# EAGLE design SparkFun_AzureWave_Module_Thing_Plus_AW-CU488 (EAGLE 9.6.2)
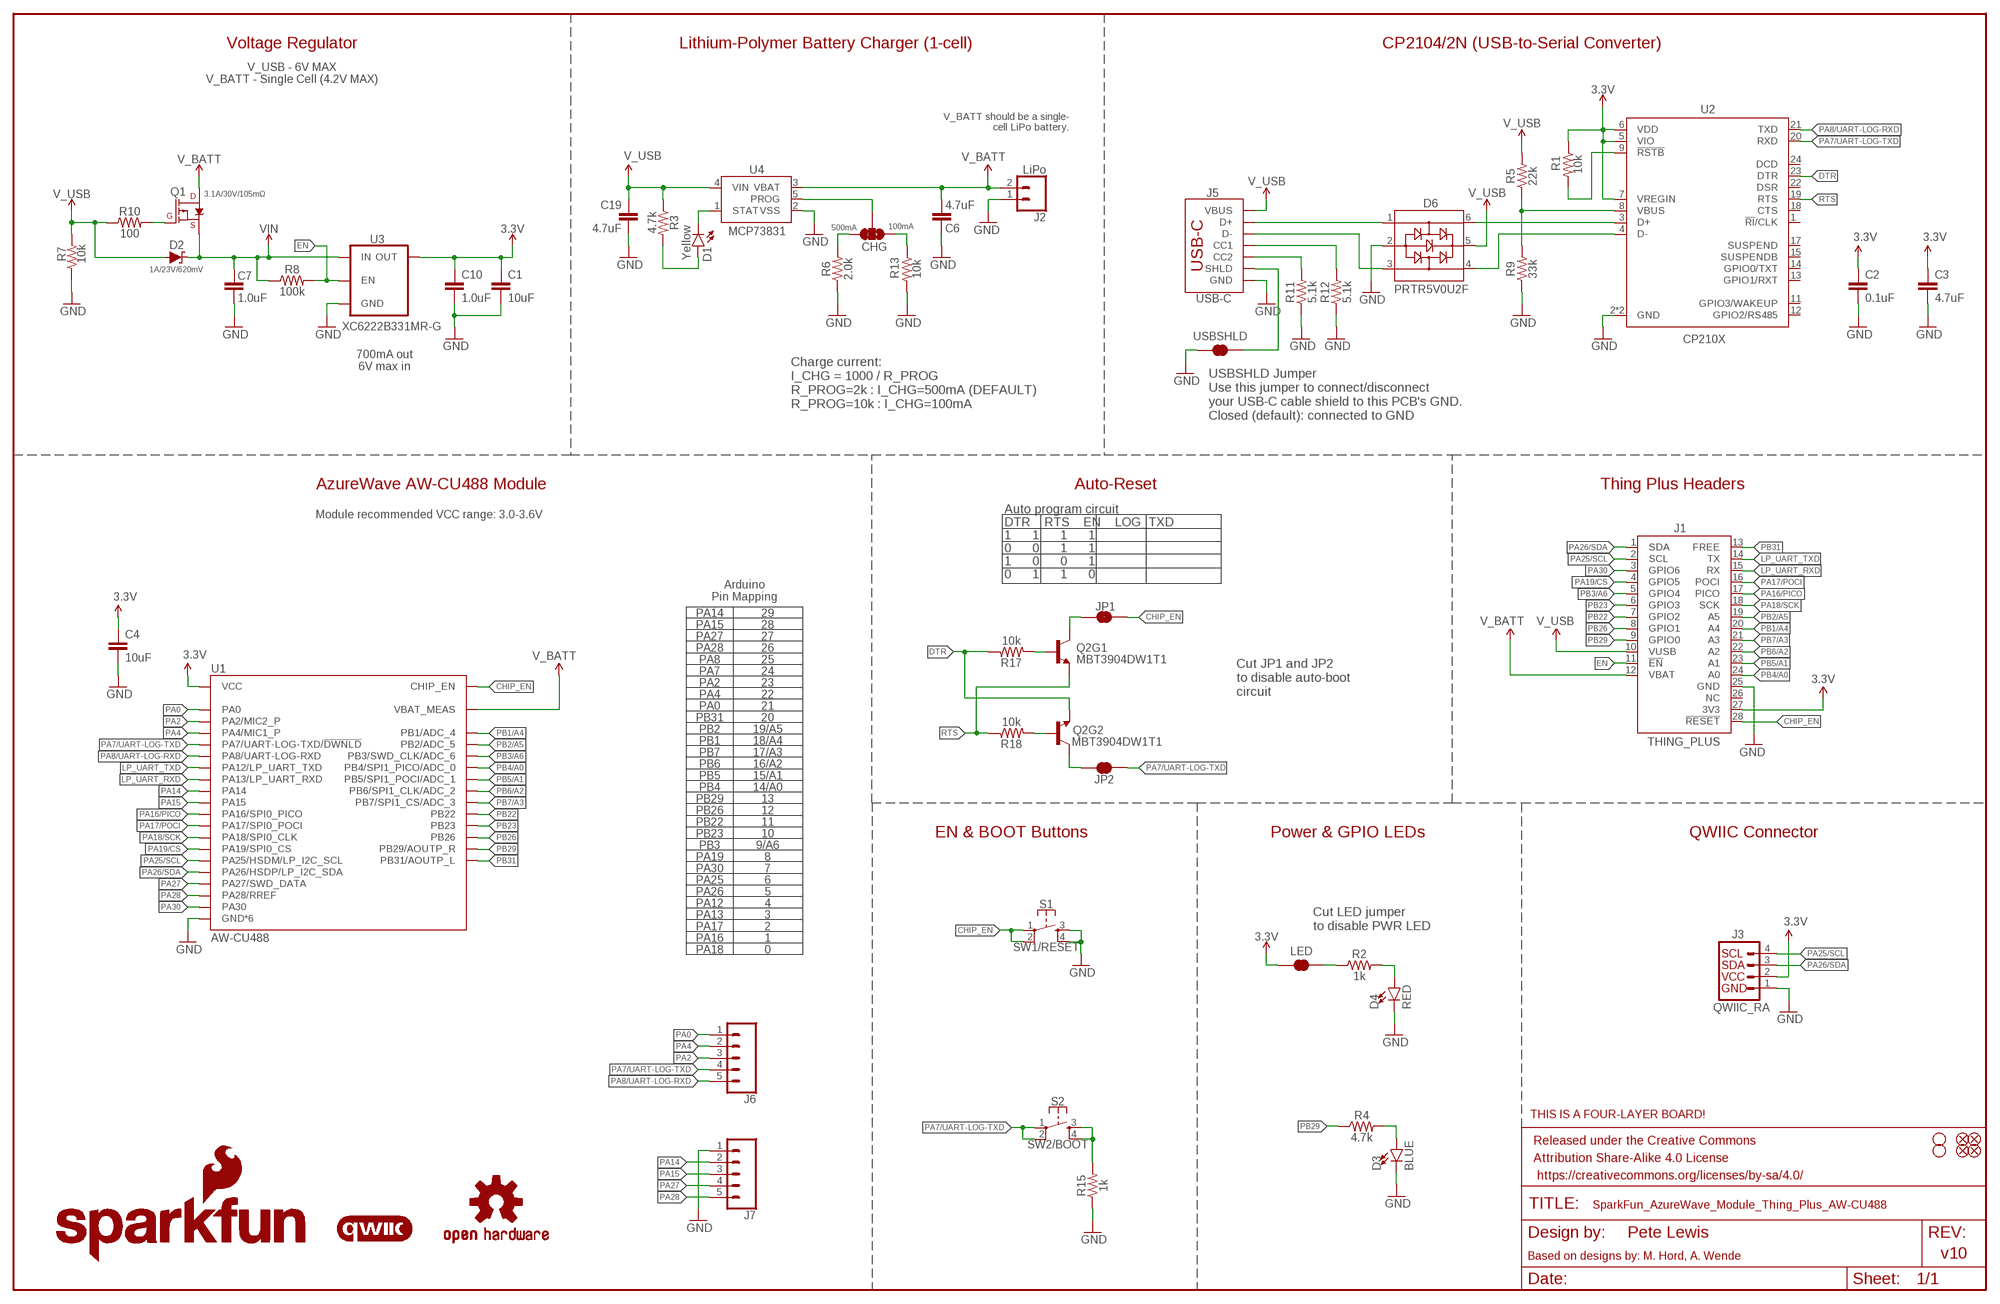
[diagram p0: schematic, sheet 1]

## Parts
C1  10uF  10UF-0402T-6.3V-20%  [0402-TIGHT]
C2  0.1uF  0.1UF-0402T-16V-10%  [0402-TIGHT]
C3  4.7uF  4.7UF-0402_TIGHT-6.3V-20%-X5R  [0402-TIGHT]
C4  10uF  10UF-0603-6.3V-20%  [0603]
C6  4.7uF  4.7UF-0402_TIGHT-6.3V-20%-X5R  [0402-TIGHT]
C7  1.0uF  1.0UF-0402T-16V-10%  [0402-TIGHT]
C10  1.0uF  1.0UF-0402T-16V-10%  [0402-TIGHT]
C19  4.7uF  4.7UF-0402_TIGHT-6.3V-20%-X5R  [0402-TIGHT]
CHG  JUMPER-SMT_3_1-NC_TRACE_SILK  [SMT-JUMPER_3_1-NC_TRACE_SILK]
D1  Yellow  LED-YELLOW0603  [LED-0603]
D2  1A/23V/620mV  DIODE-SCHOTTKY-BAT20J  [SOD-323]
D3  BLUE  LED-BLUE0603  [LED-0603]
D4  RED  LED-RED0603  [LED-0603]
D6  PRTR5V0U2F  [SOT886]
FD1  FIDUCIALUFIDUCIAL  [FIDUCIAL-MICRO]
FD2  FIDUCIALUFIDUCIAL  [FIDUCIAL-MICRO]
FD3  FIDUCIALUFIDUCIAL  [FIDUCIAL-MICRO]
FD4  FIDUCIALUFIDUCIAL  [FIDUCIAL-MICRO]
FRAME1  FRAME-LEDGER  [CREATIVE_COMMONS]
H1  STAND-OFF  [STAND-OFF]
H2  STAND-OFF  [STAND-OFF]
J1  THING_PLUS  [THING_PLUS]
J2  LiPo  CONN_02-JST-2MM-SMT  [JST-2-SMD]
J3  QWIIC_RA  QWIIC_CONNECTORJS-1MM  [JST04_1MM_RA]
J5  USB-C  USB_C_4-LAYER-ISOLATED  [USB-C-16P-4LAYER-ISOLATED]
J6  CONN_05NO_SILK  [1X05_NO_SILK]
J7  CONN_05NO_SILK  [1X05_NO_SILK]
JP1  JUMPER-SMT_2_NC_TRACE_SILK  [SMT-JUMPER_2_NC_TRACE_SILK]
JP2  JUMPER-SMT_2_NC_TRACE_SILK  [SMT-JUMPER_2_NC_TRACE_SILK]
LED  JUMPER-SMT_2_NC_TRACE_SILK  [SMT-JUMPER_2_NC_TRACE_SILK]
LOGO1  SFE_LOGO_NAME.1_INCH  [SFE_LOGO_NAME_.1]
LOGO2  OSHW-LOGOMINI  [OSHW-LOGO-MINI]
LOGO3  SFE_LOGO_NAME_FLAME.1_INCH  [SFE_LOGO_NAME_FLAME_.1]
LOGO4  FOUR_LAYER_WARNING  [FOUR_LAYER_WARNING]
LOGO6  QWIIC_LOGO_4MM  [QWIIC_4MM]
Q1  3.1A/30V/105mΩ  MOSFET_PCH-DMG2307L  [SOT23-3]
Q2  MBT3904DW1T1  TRANS_NPN_DUAL-MBT3904DW1T1  [SC70-6]
R1  10k  10KOHM-0402T-1/16W-1%  [0402-TIGHT]
R2  1k  1KOHM-0402T-1/16W-1%  [0402-TIGHT]
R3  4.7k  4.7KOHM-0402T-1/16W-1%  [0402-TIGHT]
R4  4.7k  4.7KOHM-0402T-1/16W-1%  [0402-TIGHT]
R5  22k  22KOHM-0402_TIGHT-1/10W-1%  [0402-TIGHT]
R6  2.0k  2.0KOHM-0603-1/10W-5%  [0603]
R7  10k  10KOHM-0402T-1/16W-1%  [0402-TIGHT]
R8  100k  100KOHM-0402T-1/16W-1%  [0402-TIGHT]
R9  33k  33KOHM-0402T-1/16W-1%  [0402-TIGHT]
R10  100  100OHM-0402-TIGHT-1/16W-1%  [0402-TIGHT]
R11  5.1k  5.1KOHM-0402T-1/16W-1%  [0402-TIGHT]
R12  5.1k  5.1KOHM-0402T-1/16W-1%  [0402-TIGHT]
R13  10k  10KOHM-0402T-1/16W-1%  [0402-TIGHT]
R15  1k  1KOHM-0402T-1/16W-1%  [0402-TIGHT]
R17  10k  10KOHM-0402T-1/16W-1%  [0402-TIGHT]
R18  10k  10KOHM-0402T-1/16W-1%  [0402-TIGHT]
S1  SW1/RESET  MOMENTARY-SWITCH-SPST-2-SMD-4.6X2.8MM  [TACTILE_SWITCH_SMD_4.6X2.8MM]
S2  SW2/BOOT  MOMENTARY-SWITCH-SPST-2-SMD-4.6X2.8MM  [TACTILE_SWITCH_SMD_4.6X2.8MM]
U1  AW-CU488  AW-CU488LGA150  [LGA150_AW-CU488]
U2  CP210X  CP2102N  [QFN24]
U3  XC6222B331MR-G  [SOT23-5]
U4  MCP73831  [SOT23-5]
USBSHLD  JUMPER-SMT_2_NC_TRACE_SILK  [SMT-JUMPER_2_NC_TRACE_SILK]

## Nets
3.3V: C1.1 C2.1 C3.1 C4.1 C10.1 J1.27(3V3) J3.2 LED.1 R1.1 U1.F1(VCC) U2.5(VIO) U2.6(VDD) U2.7(VREGIN) U3.5(OUT)
CC1: J5.A5(CC1) R12.2
CC2: J5.B5(CC2) R11.2
CHG: D1.C U4.1(STAT)
CHIP_EN: J1.28(!RESET) JP1.2 S1.1 S1.2 U1.K11(CHIP_EN)
DTR: Q2.1(E) R17.1 U2.23(DTR)
EN: J1.11(!EN) R8.2 U3.3(EN)
GND: C1.2 C2.2 C3.2 C4.2 C6.2 C7.2 C10.2 C19.2 D3.C D4.C D6.2 J1.25(GND) J2.1 J3.1 J5.GND J5.GND2(GND) J7.1 R6.1 R7.1 R9.1 R11.1 R12.1 R13.2 R15.1 S1.3 S1.4 U1.A1(GND*6) U1.A2(GND*6) U1.A14(GND*6) U1.A15(GND*6) U1.B14(GND*6) U1.B15(GND*6) U1.C3(GND*6) U1.C4(GND*6) U1.C5(GND*6) U1.C6(GND*6) U1.C7(GND*6) U1.C8(GND*6) U1.C9(GND*6) U1.C10(GND*6) U1.C11(GND*6) U1.C12(GND*6) U1.C13(GND*6) U1.C14(GND*6) U1.C15(GND*6) U1.D3(GND*6) U1.D4(GND*6) U1.D5(GND*6) U1.D6(GND*6) U1.D7(GND*6) U1.D8(GND*6) U1.D9(GND*6) U1.D10(GND*6) U1.D11(GND*6) U1.D12(GND*6) U1.D13(GND*6) U1.D14(GND*6) U1.D15(GND*6) U1.E1(GND*6) U1.E2(GND*6) U1.E3(GND*6) U1.E4(GND*6) U1.E5(GND*6) U1.E6(GND*6) U1.E7(GND*6) U1.E8(GND*6) U1.E9(GND*6) U1.E10(GND*6) U1.E11(GND*6) U1.E12(GND*6) U1.E13(GND*6) U1.E14(GND*6) U1.E15(GND*6) U1.F2(GND*6) U1.F3(GND*6) U1.F4(GND*6) U1.F5(GND*6) U1.F6(GND*6) U1.F7(GND*6) U1.F8(GND*6) U1.F9(GND*6) U1.F10(GND*6) U1.F11(GND*6) U1.F12(GND*6) U1.F13(GND*6) U1.F14(GND*6) U1.F15(GND*6) U1.G1(GND*6) U1.G2(GND*6) U1.G3(GND*6) U1.G4(GND*6) U1.G5(GND*6) U1.G6(GND*6) U1.G7(GND*6) U1.G8(GND*6) U1.G9(GND*6) U1.G10(GND*6) U1.G11(GND*6) U1.G12(GND*6) U1.G13(GND*6) U1.G14(GND*6) U1.G15(GND*6) U1.H3(GND*6) U1.H4(GND*6) U1.H5(GND*6) U1.H6(GND*6) U1.H7(GND*6) U1.H8(GND*6) U1.H9(GND*6) U1.H10(GND*6) U1.H11(GND*6) U1.H12(GND*6) U1.H13(GND*6) U1.H14(GND*6) U1.H15(GND*6) U1.J14(GND*6) U1.J15(GND*6) U1.K3(GND*6) U1.K4(GND*6) U1.K14(GND*6) U1.K15(GND*6) U2.2(GND) U2.PAD(GND) U3.2(GND) U4.2(VSS) USBSHLD.1
LP_UART_RXD: J1.15(RX) U1.B13(PA13/LP_UART_RXD)
LP_UART_TXD: J1.14(TX) U1.A13(PA12/LP_UART_TXD)
N$1: R1.2 U2.9(!RSTB)
N$2: D3.A R4.2
N$3: Q2.5(B) R17.2
N$4: R5.1 R9.2 U2.8(VBUS)
N$5: Q2.2(B) R18.2
N$6: JP1.1 Q2.3(C)
N$7: Q1.1(G) R10.2
N$8: R15.2 S2.3 S2.4
N$9: CHG.2 U4.5(PROG)
N$10: JP2.1 Q2.6(C)
N$11: CHG.1 R13.1
N$12: LED.2 R2.1
N$13: CHG.3 R6.2
N$14: D4.A R2.2
N$15: D6.6 U2.3(D+)
N$16: D6.1 J5.A6(D+) J5.B6(D+)
N$17: D1.A R3.2
N$18: D6.4 U2.4(D-)
N$19: D6.3 J5.A7(D-) J5.B7(D-)
PA0: J6.1 U1.K8(PA0)
PA2: J6.3 U1.K10(PA2/MIC2_P)
PA4: J6.2 U1.K9(PA4/MIC1_P)
PA7/UART-LOG-TXD: J6.4 JP2.2 S2.1 S2.2 U1.K12(PA7/UART-LOG-TXD/!DWNLD!) U2.20(RXD)
PA8/UART-LOG-RXD: J6.5 U1.K13(PA8/UART-LOG-RXD) U2.21(TXD)
PA14: J7.2 U1.A12(PA14)
PA15: J7.3 U1.B12(PA15)
PA16/PICO: J1.17(PICO) U1.A11(PA16/SPI0_PICO)
PA17/POCI: J1.16(POCI) U1.B11(PA17/SPI0_POCI)
PA18/SCK: J1.18(SCK) U1.A10(PA18/SPI0_CLK)
PA19/CS: J1.4(GPIO5) U1.B10(PA19/SPI0_CS)
PA25/SCL: J1.2(SCL) J3.4 U1.A5(PA25/HSDM/LP_I2C_SCL)
PA26/SDA: J1.1(SDA) J3.3 U1.A6(PA26/HSDP/LP_I2C_SDA)
PA27: J7.4 U1.A9(PA27/SWD_DATA)
PA28: J7.5 U1.A7(PA28/RREF)
PA30: J1.3(GPIO6) U1.A8(PA30)
PB1/A4: J1.20(A4) U1.A3(PB1/ADC_4)
PB2/A5: J1.19(A5) U1.A4(PB2/ADC_5)
PB3/A6: J1.5(GPIO4) U1.B1(PB3/SWD_CLK/ADC_6)
PB4/A0: J1.24(A0) U1.B2(PB4/SPI1_PICO/ADC_0)
PB5/A1: J1.23(A1) U1.C1(PB5/SPI1_POCI/ADC_1)
PB6/A2: J1.22(A2) U1.C2(PB6/SPI1_CLK/ADC_2)
PB7/A3: J1.21(A3) U1.D1(PB7/SPI1_CS/ADC_3)
PB22: J1.7(GPIO2) U1.K1(PB22)
PB23: J1.6(GPIO3) U1.K2(PB23)
PB26: J1.8(GPIO1) U1.K5(PB26)
PB29: J1.9(GPIO0) R4.1 U1.K6(PB29/AOUTP_R)
PB31: J1.13(FREE) U1.K7(PB31/AOUTP_L)
RTS: Q2.4(E) R18.1 U2.19(RTS)
USB_SHLD: J5.SHLD1(SHLD) J5.SHLD2(SHLD) J5.SHLD3(SHLD) J5.SHLD4(SHLD) J5.SHLD5(SHLD) J5.SHLD6(SHLD) J5.SHLD7(SHLD) J5.SHLD8(SHLD) USBSHLD.2
V_BATT: C6.1 J1.12(VBAT) J2.2 Q1.3(D) U1.D2(VBAT_MEAS) U4.3(VBAT)
V_USB: C19.1 D2.A D6.5 J1.10(VUSB) J5.VBUS1(VBUS) J5.VBUS2(VBUS) R3.1 R5.2 R7.2 R10.1 U4.4(VIN)
VIN: C7.1 D2.C Q1.2(S) R8.1 U3.1(IN)
Unconnected: J1.26(NC) U2.1(!RI!/CLK) U2.11(GPIO3/WAKEUP) U2.12(GPIO2/RS485) U2.13(GPIO1/RXT) U2.14(GPIO0/TXT) U2.15(SUSPENDB) U2.17(SUSPEND) U2.18(CTS) U2.22(DSR) U2.24(DCD)

## Notes on the sheet
- Voltage Regulator | Lithium-Polymer Battery Charger (1-cell) | CP2104/2N (USB-to-Serial Converter)
- V_USB - 6V MAX
  V_BATT - Single Cell (4.2V MAX)
- V_BATT should be a single-
  cell LiPo battery.
- 500mA | 100mA
- 700mA out
  6V max in
- Charge current:
  I_CHG = 1000 / R_PROG
  R_PROG=2k : I_CHG=500mA (DEFAULT)
  R_PROG=10k : I_CHG=100mA
- USBSHLD Jumper
  Use this jumper to connect/disconnect
  your USB-C cable shield to this PCB's GND.
  Closed (default): connected to GND
- AzureWave AW-CU488 Module | Auto-Reset | Thing Plus Headers
- Module recommended VCC range: 3.0-3.6V
- Auto program circuit
  DTR    RTS    EN    LOG_TXD
  1      1      1      1
  0      0      1      1
  1      0      0      1
  0      1      1      0
- Arduino
  Pin Mapping
- PA14 | 29
- PA15 | 28
- PA27 | 27
- PA28 | 26
- PA8 | 25
- PA7 | 24
- PA2 | 23
- Cut JP1 and JP2
  to disable auto-boot
  circuit
- PA4 | 22
- PA0 | 21
- PB31 | 20
- PB2 | 19/A5
- PB1 | 18/A4
- PB7 | 17/A3
- PB6 | 16/A2
- PB5 | 15/A1
- PB4 | 14/A0
- PB29 | 13
- PB26 | 12
- PB22 | 11
- PB23 | 10 | EN & BOOT Buttons | Power & GPIO LEDs | QWIIC Connector
- PB3 | 9/A6
- PA19 | 8
- PA30 | 7
- PA25 | 6
- PA26 | 5
- PA12 | 4
- PA13 | 3
- PA17 | 2
- Cut LED jumper 
  to disable PWR LED
- PA16 | 1
- PA18 | 0
- Pete Lewis
- v10
- Based on designs by: M. Hord, A. Wende

## Library data of the parts
C1 = SparkFun-Capacitors:10UF: 10.0µF ceramic capacitors A capacitor is a passive two-terminal electrical component used to store electrical energy temporarily in an electric field.; PROD_ID: CAP-14848
C2 = SparkFun-Capacitors:0.1UF: 0.1µF ceramic capacitors A capacitor is a passive two-terminal electrical component used to store electrical energy temporarily in an electric field.; PROD_ID: CAP-12416
C3 C6 C19 = SparkFun-Capacitors:4.7UF: 4.7µF ceramic capacitors A capacitor is a passive two-terminal electrical component used to store electrical energy temporarily in an electric field.; PROD_ID: CAP-14240
C4 = SparkFun-Capacitors:10UF: 10.0µF ceramic capacitors A capacitor is a passive two-terminal electrical component used to store electrical energy temporarily in an electric field.; PROD_ID: CAP-11015
C7 C10 = SparkFun-Capacitors:1.0UF: 1µF ceramic capacitors A capacitor is a passive two-terminal electrical component used to store electrical energy temporarily in an electric field.; PROD_ID: CAP-12417
CHG = SparkFun-Jumpers:JUMPER-SMT_3_1-NC_TRACE: Normally closed trace jumper (1 of 2 connections) This jumper has a trace between two pads so it's normally closed (NC). The other connection is normally open (NO). Use a razor knife to open the connection. For best results follow the IPC guidelines for cutting traces: Cutout at least 0.063 mm (0.005 in). Remove all loose material to clean up the cut area. Seal the cut with an approved epoxy. Reapply solder to reclose the connection, or to close the NO connection.
D1 = SparkFun-LED:LED-YELLOW: Yellow SMD LED Used in manufacturing several products at SparkFun. Packages: 0603 - SMD 0603 package[Product Link] <http://www.kingbrightusa.com/product.asp?catalog_name=LED&product_id=APT1608SYCK> 0603 -SMART - SMART SMD 0603 package (more efficient/more expensive) [Product Link] <http://www.osram-os.com/osram_os/en/products/product-catalog/led-light-emitting-diodes/smartled-0603/ly-l29k/index.jsp> LilyPad - SMD1206 package[Product Datasheet] <https://www.sparkfun.com/datasheets/DevTools/LilyPad/Q150YUS4.pdf> SparkFun Products: Blynk Board <https://www.sparkfun.com/products/13794> IOIO-OTG <https://www.sparkfun.com/products/13613> XBee Explorer Serial <https://www.sparkfun.com/products/13225>; PROD_ID: DIO-09003
D2 = SparkFun-DiscreteSemi:DIODE-SCHOTTKY: Schottky diode A Schottky diode is a semiconductor diode which has a low forward voltage drop and a very fast switching action.; PROD_ID: DIO-11623
D3 = SparkFun-LED:LED-BLUE: Blue SMD LED Used in manufacturing of various products at SparkFun Packages: 0603 - SMD 0603 package [Product Link] <http://www.digikey.com/product-detail/en/SMLE12BC7TT86/511-1589-2-ND/1641808> 1206 - SMD1206 package [Product Link] <http://www.digikey.com/product-detail/en/lite-on-inc/LTST-C150TBKT/160-1643-1-ND/573584> SparkFun Products: ESP8266 Thing-Dev Board <https://www.sparkfun.com/products/13711> RedBoard <https://www.sparkfun.com/products/12757>; PROD_ID: DIO-08575
D4 = SparkFun-LED:LED-RED: Red SMD LED Used in manufacturing of most products at SparkFun Packages: 0603 - SMD 0603 package [Product Link] <http://docs.avagotech.com/docs/AV02-0551EN> 0603 SMART - SMD 0603 SMART package ( more efficient and expensive)[Product Link] <http://www.osram-os.com/Graphics/XPic2/00077099_0.pdf> 1206 - SMD1206 package [Product Link] <https://www.sparkfun.com/datasheets/DevTools/LilyPad/Q150OVS4.pdff> SparkFun Products: Pro Mini 328 -5V <https://www.sparkfun.com/products/821> RedBoard <https://www.sparkfun.com/products/12757> IOIO-OTG <https://www.sparkfun.com/products/13613>; PROD_ID: DIO-00819
D6 = SparkFun-IC-Power:PRTR5V0U2: A small ESD protection device. Most commonly used on USB D+/D- signals to protect large, expensive, or especially sensitive USB enabled devices.; PROD_ID: DIO-14084
FD1-FD4 = SparkFun-Aesthetics:FIDUCIAL: Fiducial Alignment Points Point-of-reference for pick-and-place machines and other optical instruments.
FRAME1 = SparkFun-Aesthetics:FRAME-LEDGER: Schematic Frame - Ledger Standard 11x14 US Ledger frame
H1 H2 = SparkFun-Hardware:STAND-OFF: Stand Off Drill holes for mechanically mounting via screws, standoffs, etc. Note: Use the keepout ring to avoid running the screw head into surrounding components. Variant Overviews STAND-OFF - Mechanical footprint for a #4 phillips button head screw. STAND-OFF-TIGHT - Mechanical footprint for a #4 phillips button head screw, Example SparkFun Products Screw - Phillips Head (1/4", 4-40, 10 pack) <https://www.sparkfun.com/products/10453> (PRT-10453) Screw - Phillips Head (1/2", 4-40, 10 pack) <https://www.sparkfun.com/products/10452> (PRT-10452) Screw - Phillips Head (3/4", 4-40, 10 pack) <https://www.sparkfun.com/products/10451> (PRT-10451) Screw - Phillips Head (1", 4-40, 10 pack) <https://www.sparkfun.com/products/10450> (PRT-10450)
J1 = SparkFun-Boards:THING_PLUS
J2 = SparkFun-Connectors:CONN_02: Multi connection point. Often used as Generic Header-pin footprint for 0.1 inch spaced/style header connections On any of the 0.1 inch spaced packages, you can populate with these: Break Away Headers - Straight <https://www.sparkfun.com/products/116> (PRT-00116) Break Away Male Headers - Right Angle <https://www.sparkfun.com/products/553> (PRT-00553) Female Headers <https://www.sparkfun.com/products/115> (PRT-00115) Break Away Headers - Machine Pin <https://www.sparkfun.com/products/117> (PRT-00117) Break Away Female Headers - Swiss Machine Pin <https://www.sparkfun.com/products/743> (PRT-00743) For SCREWTERMINALS and SPRING TERMINALS visit here: Screw Terimnals on SparkFun.com <https://www.sparkfun.com/search/results?term=Screw+Terminals> (5mm/3.5mm/2.54mm spacing) This device is also useful as a general connection point to wire up your design to another part of your project. Our various solder wires solder well into these plated through hole pads. Hook-Up Wire - Assortment (Stranded, 22 AWG) <https://www.sparkfun.com/products/11375> (PRT-11375) Hook-Up Wire - Assortment (Solid Core, 22 AWG) <https://www.sparkfun.com/products/11367> (PRT-11367) View the entire wire category on our website here <https://www.sparkfun.com/categories/141> Special notes: Molex polarized connector foot print use with: PRT-08233 with associated crimp pins and housings. 2.54_SCREWTERM for use with PRT-10571. 3.5mm Screw Terminal footprints for PRT-08084 5mm Screw Terminal footprints for use with PRT-08432; PROD_ID: CONN-11443
J3 = SparkFun-Connectors:QWIIC_CONNECTOR: SparkFun I2C Standard Qwiic Connector An SMD 1mm pitch JST connector makes it easy and quick (get it? Qwiic?) to connect I2C devices to each other. The Qwiic system <http://www.sparkfun.com/qwiic> enables fast and solderless connection between popular platforms and various sensors and actuators. We carry 200mm <https://www.sparkfun.com/products/14204>, 100mm <https://www.sparkfun.com/products/14205>, 50mm <https://www.sparkfun.com/products/14206>, and breadboard friendly <https://www.sparkfun.com/products/14207> Qwiic cables. We also offer 10 pcs strips <https://www.sparkfun.com/products/14323> the SMD connectors.; PROD_ID: CONN-13694; VALUE: QWIIC_RIGHT_ANGLE
J5 = SparkFun-Connectors:USB_C: USB Type C 16Pin Connector Super Speed pins not available on the 16-pin purely SMD connector so this part is best for USB 2.0 implementations. D1 and D2 are tied together enabling D+/- no matter which way the cable is plugged into the connector. The two channel configuration pins (CC1/2) are exposed. These are normally connected to ground via 5.1k resistors but can be reconfigured for high current/high power applications. **4-LAYER BOARD WARNING!!** If designing 4-layer board, make sure to select the variant _4-LAYER-ISOLATED. The linked footprint (USB-C-16-4LAYER-ISOLATED) includes some very necessary cutout polygons in the inner layers (2 and 15). This prevents the PTH mounting shield legs on the USB connector from electrically connecting any other polygons on the inner layers (usually VCC and GND).; PROD_ID: CONN-14122; VALUE: USB Female Type C Connector
J6 J7 = SparkFun-Connectors:CONN_05: Multi connection point. Often used as Generic Header-pin footprint for 0.1 inch spaced/style header connections On any of the 0.1 inch spaced packages, you can populate with these: Break Away Headers - Straight <https://www.sparkfun.com/products/116> (PRT-00116) Break Away Male Headers - Right Angle <https://www.sparkfun.com/products/553> (PRT-00553) Female Headers <https://www.sparkfun.com/products/115> (PRT-00115) Break Away Headers - Machine Pin <https://www.sparkfun.com/products/117> (PRT-00117) Break Away Female Headers - Swiss Machine Pin <https://www.sparkfun.com/products/743> (PRT-00743) For SCREWTERMINALS and SPRING TERMINALS visit here: Screw Terimnals on SparkFun.com <https://www.sparkfun.com/search/results?term=Screw+Terminals> (5mm/3.5mm/2.54mm spacing) This device is also useful as a general connection point to wire up your design to another part of your project. Our various solder wires solder well into these plated through hole pads. Hook-Up Wire - Assortment (Stranded, 22 AWG) <https://www.sparkfun.com/products/11375> (PRT-11375) Hook-Up Wire - Assortment (Solid Core, 22 AWG) <https://www.sparkfun.com/products/11367> (PRT-11367) View the entire wire category on our website here <https://www.sparkfun.com/categories/141> Special notes: Molex polarized connector foot print use with SKU : PRT-08231 with associated crimp pins and housings. 1MM SMD Version SKU: PRT-10208
JP1 JP2 LED USBSHLD = SparkFun-Jumpers:JUMPER-SMT_2_NC_TRACE: Normally closed trace jumper This jumper has a trace between two pads so it's normally closed (NC). Use a razor knife to open the connection. For best results follow the IPC guidelines for cutting traces: Cutout at least 0.063 mm (0.005 in). Remove all loose material to clean up the cut area. Seal the cut with an approved epoxy. Reapply solder to reclose the connection.
LOGO1 = SparkFun-Aesthetics:SFE_LOGO_NAME: SparkFun Font Logo This is the SparkFun name logo. The logo on the schematic will always be the same size; the package variant is the height of the flame part of the logo (or the height the flame would be, if it were drawn). Default layer for the logo on the board is tSilk.
LOGO2 = SparkFun-Aesthetics:OSHW-LOGO: Open-Source Hardware (OSHW) Logo This logo indicates the piece of hardware it is found on incorporates a OSHW license and/or adheres to the definition of open source hardware found here: http://freedomdefined.org/OSHW
LOGO3 = SparkFun-Aesthetics:SFE_LOGO_NAME_FLAME: SparkFun Font Logo w/ Flame This is the SparkFun full logo. The logo on the schematic will always be the same size; the package variant is the height of the flame part of the logo. Default layer for the logo on the board is tSilk.
LOGO4 = SparkFun-Aesthetics:FOUR_LAYER_WARNING: Four-Layer Board Warning - tDoc Layer Warning text which will appear on both the schematic and the board file, notifying viewers that the design is a four-layer PCB.
LOGO6 = SparkFun-Aesthetics:QWIIC_LOGO: Qwiic Logos for placement on schematic and PCB. The 5.5mm silk logo is best for placing next to Qwiic connector.
Q1 = SparkFun-DiscreteSemi:MOSFET_PCH: P-channel MOSFETs Voltage controlled devices that allow control of high current outputs. SparkFun Products: SparkFun ESP32 Thing <https://www.sparkfun.com/products/13907> SparkFun ESP8266 Thing <https://www.sparkfun.com/products/13231> SparkFun Pi Servo HAT V2 <https://www.sparkfun.com/products/15316> DMG2305UX-7 (20V/4.2A/SOT23-3); PROD_ID: TRANS-11308
Q2 = SparkFun-DiscreteSemi:TRANS_NPN_DUAL: Dual NPN Transistors in Single Package The MBT3904W1 puts two general purpose 3904 NPN transistors in a single package. Datasheet <http://www.onsemi.com/pub_link/Collateral/MBT3904DW1T1-D.PDF> SparkFun Products: SparkFun ESP32 Thing <https://www.sparkfun.com/products/13907>; PROD_ID: TRANS-13337
R1 R7 R13 R17 R18 = SparkFun-Resistors:10KOHM: 10kΩ resistor A resistor is a passive two-terminal electrical component that implements electrical resistance as a circuit element. Resistors act to reduce current flow, and, at the same time, act to lower voltage levels within circuits. - Wikipedia; PROD_ID: RES-14241
R2 R15 = SparkFun-Resistors:1KOHM: 1kΩ resistor A resistor is a passive two-terminal electrical component that implements electrical resistance as a circuit element. Resistors act to reduce current flow, and, at the same time, act to lower voltage levels within circuits. - Wikipedia; PROD_ID: RES-14342
R3 R4 = SparkFun-Resistors:4.7KOHM: 4.7kΩ resistor A resistor is a passive two-terminal electrical component that implements electrical resistance as a circuit element. Resistors act to reduce current flow, and, at the same time, act to lower voltage levels within circuits. - Wikipedia; PROD_ID: RES-15343
R5 = SparkFun-Resistors:22KOHM: 22kΩ resistor A resistor is a passive two-terminal electrical component that implements electrical resistance as a circuit element. Resistors act to reduce current flow, and, at the same time, act to lower voltage levels within circuits. - Wikipedia; PROD_ID: RES-14281
R6 = SparkFun-Resistors:2.0KOHM: 2kΩ resistor A resistor is a passive two-terminal electrical component that implements electrical resistance as a circuit element. Resistors act to reduce current flow, and, at the same time, act to lower voltage levels within circuits. - Wikipedia; PROD_ID: RES-08296
R8 = SparkFun-Resistors:100KOHM: 100kΩ resistor A resistor is a passive two-terminal electrical component that implements electrical resistance as a circuit element. Resistors act to reduce current flow, and, at the same time, act to lower voltage levels within circuits. - Wikipedia; PROD_ID: RES-13495
R9 = SparkFun-Resistors:33KOHM: 33kΩ resistor A resistor is a passive two-terminal electrical component that implements electrical resistance as a circuit element. Resistors act to reduce current flow, and, at the same time, act to lower voltage levels within circuits. - Wikipedia; PROD_ID: RES-15128
R10 = SparkFun-Resistors:100OHM: 100Ω resistor A resistor is a passive two-terminal electrical component that implements electrical resistance as a circuit element. Resistors act to reduce current flow, and, at the same time, act to lower voltage levels within circuits. - Wikipedia; PROD_ID: RES-14962
R11 R12 = SparkFun-Resistors:5.1KOHM; PROD_ID: RES-14340
S1 S2 = SparkFun-Switches:MOMENTARY-SWITCH-SPST-2: Momentary Switch (Pushbutton) - SPST - Two Circuits Normally-open (NO) SPST momentary switches (buttons, pushbuttons). Schematic symbol includes two switch circuits. Variants SMD-4.6MMX2.8MM - 4.60mm x 2.80mm Tactile Momentary Button Switch - Used on SparkFun Pro Micro - RP2040 <https://www.sparkfun.com/products/17717> SMD-5.2MM - Mini Pushbutton Switch - SMD <https://www.sparkfun.com/products/8720> - Used on Arduino Pro Mini <https://www.sparkfun.com/products/11114>; PROD_ID: SWCH-15606
U1 = temp:AW-CU488; PROD_ID: IC-16762
U2 = SparkFun-IC-Comms:CP2102N; PROD_ID: IC-14020
U3 = SparkFun-IC-Power:XC6222; IOUT: 700mA; PROD_ID: VREG-16775; VOUT: 3.3V
U4 = SparkFun-IC-Power:MCP73831: MCP73831T Li-Ion, Li-Pol Controller Miniature single cell, fully integrated Li-Ion, Li-polymer charge management controller Datasheet <http://ww1.microchip.com/downloads/en/DeviceDoc/20001984g.pdf> SparkFun Products: SparkFun ESP32 Thing <https://www.sparkfun.com/products/13907> SparkFun 9DoF Razor IMU M0 <https://www.sparkfun.com/products/14001>; PROD_ID: IC-09995

## Board
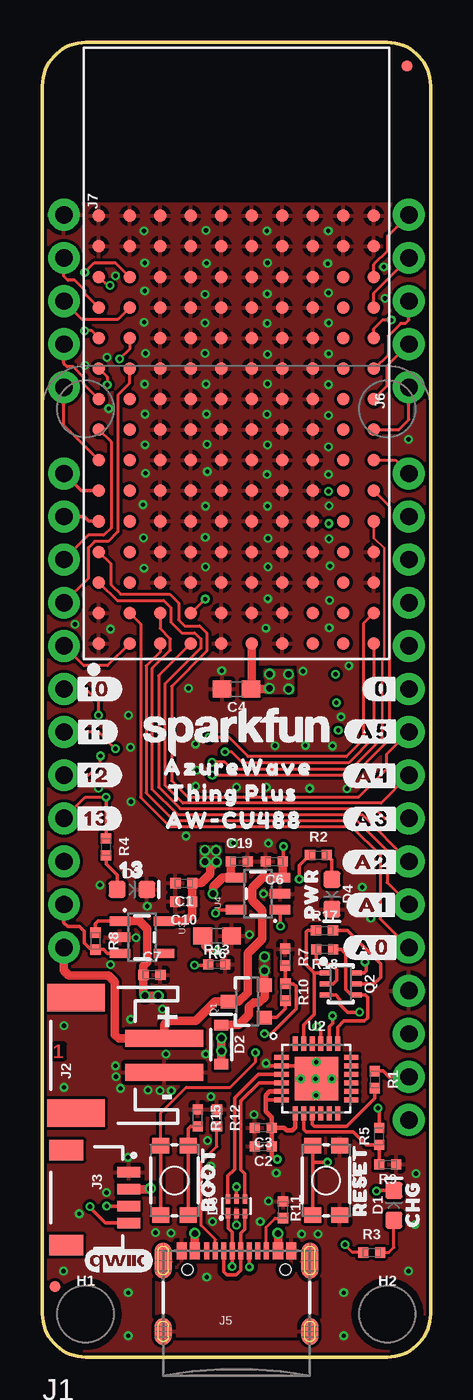
[diagram p1: board, top side]
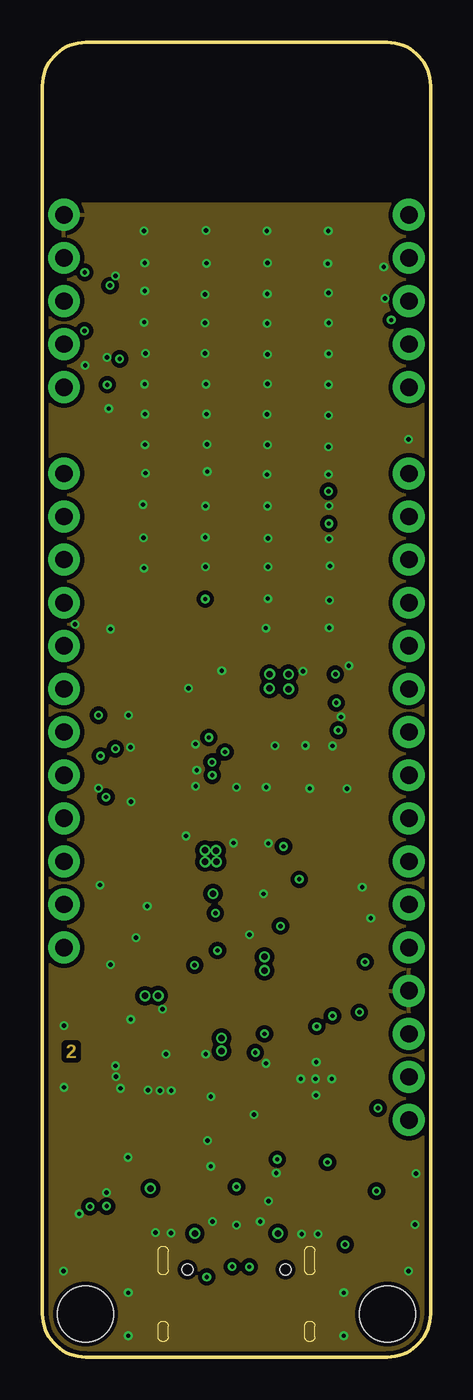
[diagram p2: board, inner layer Route2]
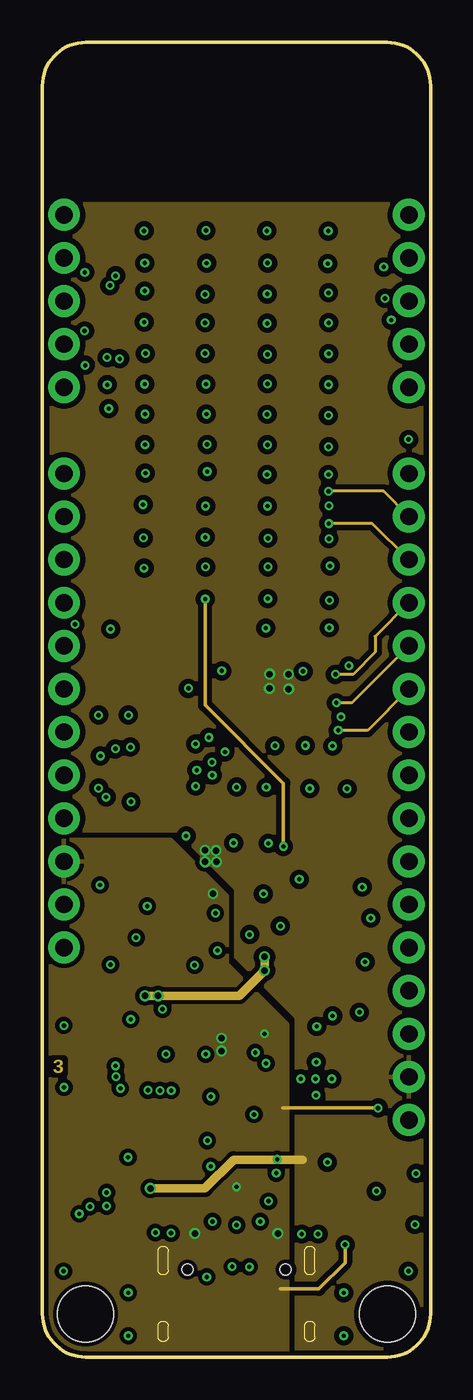
[diagram p3: board, inner layer Route15]
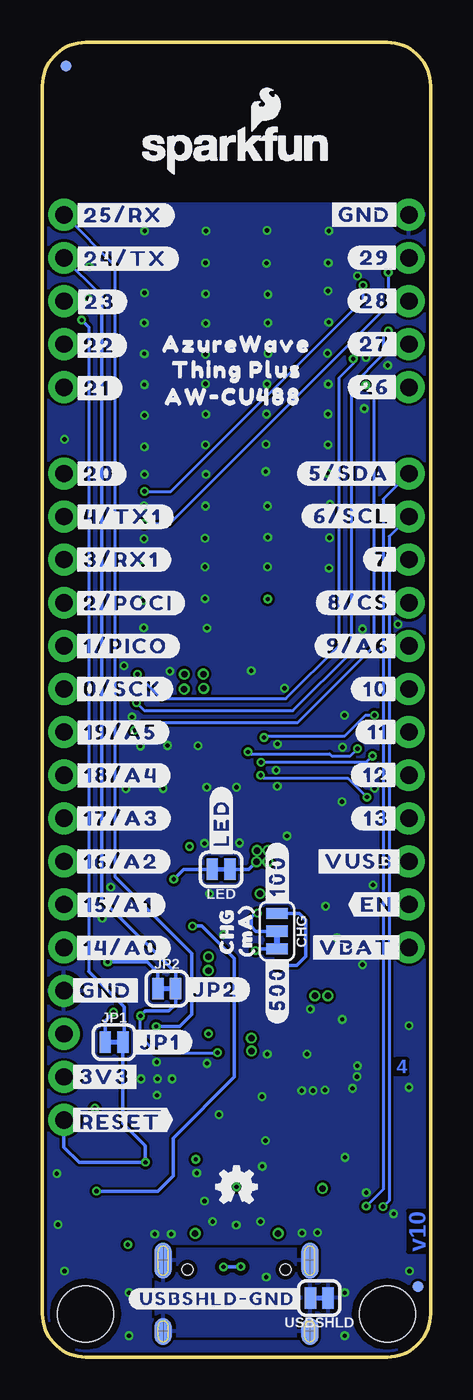
[diagram p4: board, bottom side, seen from below]

Size 22.86 x 77.47 mm. Coordinates in mm from the lower left corner, seen from the top.
Outline: 22.86,2.54 22.86,74.93 arc90 20.32,77.47 2.54,77.47 arc90 0,74.93 0,2.54 arc90 2.54,0 20.32,0 arc90 22.86,2.54
Copper layers (1*2*15*16): Top 0.035559375mm / dielectric 0.47751875mm / Route2 0.035559375mm / dielectric 0.47751875mm / Route15 0.035559375mm / dielectric 0.47751875mm / Bottom 0.035559375mm
Design rules "SparkFun-4-Layer-Minimum-JLCPCB *": minimum track width 5mil, minimum drill 0.2mm, track to track 5mil, track to pad 5mil, pad to pad 5mil, via to via 5mil, smd to smd 5mil, copper to edge 7mil, drill to drill 7mil, minimum pad ring 5mil, minimum via ring 5mil, stop-mask expansion 2.5mil, vias tented up to drill 25mil, thermal gap 10mil
tRestrict: area 17.5,16.3 to 17.6,16.5; area 14.7,16.3 to 14.8,16.6; area 16,15 to 16.3,15.1; area 16,17.8 to 16.2,17.8

### Footprints (pad centres in the part's own frame; a part is rotated, then mirrored left to right if it is on the bottom)
0402-TIGHT = smd 0.6 x 0.6: 1 -0.5,0; 2 0.5,0
0603 = smd 1.1 x 1: 1 -0.85,0; 2 0.85,0
SMT-JUMPER_3_1-NC_TRACE_SILK = smd 0.66 x 1.27: 1 -1.041,0; 2 0,0; 3 1.041,0
LED-0603 = smd 1 x 1: A -0.877,0; C 0.877,0
SOD-323 = smd 0.63 x 0.83: A 1.15,0; C -1.15,0
SOT886 = smd 0.61 x 0.25: 1 -0.405,0.5 | smd 0.56 x 0.25: 2 -0.43,0; 3 -0.43,-0.5; 4 0.43,-0.5; 5 0.43,0; 6 0.43,0.5
FIDUCIAL-MICRO = smd 0.635 x 0.635: 1 0,0
STAND-OFF = hole 3.302: 0,0
THING_PLUS = drill 1.016 pad 1.88: 1 1.27,52.07; 2 1.27,49.53; 3 1.27,46.99; 4 1.27,44.45; 5 1.27,41.91; 6 1.27,39.37; 7 1.27,36.83; 8 1.27,34.29; 9 1.27,31.75; 10 1.27,29.21; 11 1.27,26.67; 12 1.27,24.13; 13 21.59,52.07; 14 21.59,49.53; 15 21.59,46.99; 16 21.59,44.45; 17 21.59,41.91; 18 21.59,39.37; 19 21.59,36.83; 20 21.59,34.29; 21 21.59,31.75; 22 21.59,29.21; 23 21.59,26.67; 24 21.59,24.13; 25 21.59,21.59; 26 21.59,19.05; 27 21.59,16.51; 28 21.59,13.97
JST-2-SMD = smd 1 x 4.6: 1 -1,-3.7; 2 1,-3.7 | smd 1.6 x 3.4: NC1 -3.4,1.5; NC2 3.4,1.5
JST04_1MM_RA = smd 0.6 x 1.35: 1 -1.5,0; 2 -0.5,0; 3 0.5,0; 4 1.5,0 | smd 1.2 x 2: NC1 2.8,-3.675; NC2 -2.8,-3.675
USB-C-16P-4LAYER-ISOLATED = smd 0.3 x 1: A5 -1.25,-0.34; A6 -0.25,-0.34; A7 0.25,-0.34; A8 1.25,-0.34; B5 1.75,-0.34; B6 0.75,-0.34; B7 -0.75,-0.34; B8 -1.75,-0.34 | smd 0.6 x 1: GND -3.225,-0.34; GND2 3.225,-0.34; VBUS1 -2.45,-0.34; VBUS2 2.45,-0.34 | smd 1 x 2.1: SHLD1 -4.32,-0.915; SHLD2 4.32,-0.915 | smd 1 x 2.1 bottom: SHLD3 -4.32,-0.915; SHLD4 4.32,-0.915 | smd 1 x 1.6: SHLD5 -4.32,-5.095; SHLD8 4.32,-5.095 | smd 1 x 1.6 bottom: SHLD6 -4.32,-5.095; SHLD7 4.32,-5.095 | hole 0.65: -2.89,-1.445; 2.89,-1.445
1X05_NO_SILK = drill 1.016 pad 1.88: 1 0,0; 2 2.54,0; 3 5.08,0; 4 7.62,0; 5 10.16,0
SMT-JUMPER_2_NC_TRACE_SILK = smd 0.66 x 1.27: 1 -0.521,0; 2 0.521,0
SOT23-3 = smd 0.8 x 0.9: 1 -0.95,-1; 2 0.95,-1; 3 0,1.1
SC70-6 = smd 0.3 x 0.66: 1 -0.65,-0.92; 2 0,-0.92; 3 0.65,-0.92; 4 0.65,0.92; 5 0,0.92; 6 -0.65,0.92
TACTILE_SWITCH_SMD_4.6X2.8MM = smd 0.9 x 1: 1 -2.05,-0.8; 2 2.05,-0.8; 3 2.05,0.8; 4 -2.05,0.8
LGA150_AW-CU488 = smd 0.75 x 0.75: A1 15.1,-8.1; A2 13.3,-8.1; A3 11.5,-8.1; A4 9.7,-8.1; A5 7.9,-8.1; A6 6.1,-8.1; A7 4.3,-8.1; A8 2.5,-8.1; A9 0.7,-8.1; A10 -1.1,-8.1; A11 -2.9,-8.1; A12 -4.7,-8.1; A13 -6.5,-8.1; A14 -8.3,-8.1; A15 -10.1,-8.1; B1 15.1,-6.3; B2 13.3,-6.3; B3 11.5,-6.3; B4 9.7,-6.3; B5 7.9,-6.3; B6 6.1,-6.3; B7 4.3,-6.3; B8 2.5,-6.3; B9 0.7,-6.3; B10 -1.1,-6.3; B11 -2.9,-6.3; B12 -4.7,-6.3; B13 -6.5,-6.3; B14 -8.3,-6.3; B15 -10.1,-6.3; C1 15.1,-4.5; C2 13.3,-4.5; C3 11.5,-4.5; C4 9.7,-4.5; C5 7.9,-4.5; C6 6.1,-4.5; C7 4.3,-4.5; C8 2.5,-4.5; C9 0.7,-4.5; C10 -1.1,-4.5; C11 -2.9,-4.5; C12 -4.7,-4.5; C13 -6.5,-4.5; C14 -8.3,-4.5; C15 -10.1,-4.5; D1 15.1,-2.7; D2 13.3,-2.7; D3 11.5,-2.7; D4 9.7,-2.7; D5 7.9,-2.7; D6 6.1,-2.7; D7 4.3,-2.7; D8 2.5,-2.7; D9 0.7,-2.7; D10 -1.1,-2.7; D11 -2.9,-2.7; D12 -4.7,-2.7; D13 -6.5,-2.7; D14 -8.3,-2.7; D15 -10.1,-2.7; E1 15.1,-0.9; E2 13.3,-0.9; E3 11.5,-0.9; E4 9.7,-0.9; E5 7.9,-0.9; E6 6.1,-0.9; E7 4.3,-0.9; E8 2.5,-0.9; E9 0.7,-0.9; E10 -1.1,-0.9; E11 -2.9,-0.9; E12 -4.7,-0.9; E13 -6.5,-0.9; E14 -8.3,-0.9; E15 -10.1,-0.9; F1 15.1,0.9; F2 13.3,0.9; F3 11.5,0.9; F4 9.7,0.9; F5 7.9,0.9; F6 6.1,0.9; F7 4.3,0.9; F8 2.5,0.9; F9 0.7,0.9; F10 -1.1,0.9; F11 -2.9,0.9; F12 -4.7,0.9; F13 -6.5,0.9; F14 -8.3,0.9; F15 -10.1,0.9; G1 15.1,2.7; G2 13.3,2.7; G3 11.5,2.7; G4 9.7,2.7; G5 7.9,2.7; G6 6.1,2.7; G7 4.3,2.7; G8 2.5,2.7; G9 0.7,2.7; G10 -1.1,2.7; G11 -2.9,2.7; G12 -4.7,2.7; G13 -6.5,2.7; G14 -8.3,2.7; G15 -10.1,2.7; H1 15.1,4.5; H2 13.3,4.5; H3 11.5,4.5; H4 9.7,4.5; H5 7.9,4.5; H6 6.1,4.5; H7 4.3,4.5; H8 2.5,4.5; H9 0.7,4.5; H10 -1.1,4.5; H11 -2.9,4.5; H12 -4.7,4.5; H13 -6.5,4.5; H14 -8.3,4.5; H15 -10.1,4.5; J1 15.1,6.3; J2 13.3,6.3; J3 11.5,6.3; J4 9.7,6.3; J5 7.9,6.3; J6 6.1,6.3; J7 4.3,6.3; J8 2.5,6.3; J9 0.7,6.3; J10 -1.1,6.3; J11 -2.9,6.3; J12 -4.7,6.3; J13 -6.5,6.3; J14 -8.3,6.3; J15 -10.1,6.3; K1 15.1,8.1; K2 13.3,8.1; K3 11.5,8.1; K4 9.7,8.1; K5 7.9,8.1; K6 6.1,8.1; K7 4.3,8.1; K8 2.5,8.1; K9 0.7,8.1; K10 -1.1,8.1; K11 -2.9,8.1; K12 -4.7,8.1; K13 -6.5,8.1; K14 -8.3,8.1; K15 -10.1,8.1
QFN24 = smd 0.85 x 0.3: 1 -2.05,1.25; 2 -2.05,0.75; 3 -2.05,0.25; 4 -2.05,-0.25; 5 -2.05,-0.75; 6 -2.05,-1.25; 13 2.05,-1.25; 14 2.05,-0.75; 15 2.05,-0.25; 16 2.05,0.25; 17 2.05,0.75; 18 2.05,1.25 | smd 0.3 x 0.85: 7 -1.25,-2.05; 8 -0.75,-2.05; 9 -0.25,-2.05; 10 0.25,-2.05; 11 0.75,-2.05; 12 1.25,-2.05; 19 1.25,2.05; 20 0.75,2.05; 21 0.25,2.05; 22 -0.25,2.05; 23 -0.75,2.05; 24 -1.25,2.05 | smd 2.55 x 2.55: PAD 0,0
SOT23-5 = smd 0.55 x 1.2: 1 -0.95,-1.3; 2 0,-1.3; 3 0.95,-1.3; 4 0.95,1.3; 5 -0.95,1.3

### Placement (x,y rotation side)
C1  8.33,27.93 180 top
C2  13.01,12.42 180 top
C3  13.01,13.51 180 top
C4  11.43,39.37 180 top
C6  13.66,29.2 180 top
C7  6.45,22.53 0 top
C10  8.32,26.84 180 top
C19  11.6,29.21 0 top
CHG  9.04,25.1 270 bottom
D1  20.7,8.94 90 top
D2  10.54,18.41 270 top
D3  5.28,27.56 0 top
D4  17.05,27.27 270 top
D6  11.43,8.89 90 top
FD1  21.46,76.07 0 top
FD2  21.46,76.07 0 bottom
FD3  0.74,4.14 0 top
FD4  0.74,4.14 0 bottom
FRAME1  -17.14,-20.32 0 top  (outside the outline)
H1  2.54,2.54 0 top
H2  20.32,2.54 0 top
J1  0,0 0 top
J2  3.48,17.78 90 top
J3  5.08,9.4 270 top
J5  11.43,6.6 0 top
J6  21.59,57.15 90 top
J7  1.27,67.31 270 top
JP1  18.64,18.55 0 bottom
JP2  15.54,21.71 0 bottom
LED  12.34,28.74 180 bottom
LOGO1  11.43,36.83 0 top
LOGO2  11.43,10.04 0 bottom
LOGO3  11.43,71.12 0 bottom
LOGO4  30.48,39.37 0 top  (outside the outline)
LOGO6  4.5,5.67 0 top
Q1  12.06,20.95 90 top
Q2  17.57,21.98 270 top
R1  19.58,16.35 270 top
R2  16.26,29.59 0 top
R3  19.39,6.16 0 top
R4  3.75,30.07 270 top
R5  19.83,13.01 90 top
R6  10.29,24.83 180 top
R7  14.31,23.57 270 top
R8  3.12,24.51 270 top
R9  20.34,11.35 180 top
R10  14.32,21.5 270 top
R11  14.17,8.69 270 top
R12  10.28,14.09 270 top
R13  10.26,23.14 0 top
R15  9.14,14.1 270 top
R17  16.61,25.13 0 top
R18  16.63,24.02 180 top
S1  16.71,10.41 270 top
S2  7.78,10.41 270 top
U1  11.43,57.15 270 top
U2  16.14,16.41 0 top
U3  5.87,24.74 270 top
U4  12.7,27.3 90 top
U$1  [#10#30]  3.22,39.36 0 top
U$2  [BOOT0]  9.78,10.52 90 top
U$3  [CHG0]  11.99,25.09 90 bottom
U$4  [#500#0]  9.03,23.74 90 bottom
U$5  [#11#30]  3.1,36.84 0 top
U$6  [AZUREWAVE0]  11.52,34.76 0 top
U$7  [1330]  5.29,28.71 0 top
U$8  [AZUREWAVE0]  11.43,59.69 0 bottom
U$9  [AW#CU488_0]  11.45,56.58 0 bottom
U$10  [THING_PLUS_0]  11.23,58.18 0 bottom
U$11  [MA0]  10.91,25.16 90 bottom
U$12  [#12#30]  3.21,34.3 0 top
U$14  [#13#30]  3.2,31.74 0 top
U$15  [#JP1#1]  15.94,18.56 0 bottom
U$16  [#0#1]  20,39.37 0 top
U$18  [#A0#30]  19.45,24.13 0 top
U$19  [#JP2#4]  12.67,21.65 0 bottom
U$20  [#USBSHLD#GND#3]  12.57,3.43 0 bottom
U$23  [PWR0]  15.84,27.31 90 top
U$27  [AW#CU488_0]  11.44,31.62 0 top
U$29  [#LED#0]  12.32,31.45 90 bottom
U$32  [#GND#0]  21.38,21.6 0 bottom
U$41  [#VUSB#0]  1.5,29.21 0 bottom
U$42  [#VBAT#0]  1.5,24.13 0 bottom
U$43  [#EN#0]  1.5,26.67 0 bottom
U$45  [#3V3#0]  21.38,16.52 0 bottom
U$46  [##RESET##0]  21.38,13.98 0 bottom
U$48  [#4#TX1#14]  18.13,49.52 0 bottom
U$49  [#3#RX1#14]  18.21,46.99 0 bottom
U$50  [#2#POCI#14]  17.81,44.43 0 bottom
U$53  [#A1#6]  19.5,26.64 0 top
U$54  [#A2#6]  19.41,29.17 0 top
U$55  [#A3#6]  19.43,31.7 0 top
U$56  [#A4#6]  19.42,34.26 0 top
U$57  [#A5#6]  19.46,36.87 0 top
U$59  [ORDERING_INSTRUCTIONS]  29.21,50.8 0 top  (outside the outline)
U$60  [#100#0]  9.03,26.41 90 bottom
U$62  [THING_PLUS_0]  11.39,33.23 0 top
U$64  [#1#PICO#14]  17.96,41.89 0 bottom
U$67  [#13#14]  3.2,31.75 0 bottom
U$68  [#12#14]  3.21,34.3 0 bottom
U$69  [#11#14]  3.08,36.83 0 bottom
U$70  [#10#14]  3.22,39.37 0 bottom
U$71  [#9#A6#14]  4.27,41.91 0 bottom
U$72  [#8#CS#14]  4.24,44.45 0 bottom
U$73  [#7#14]  2.84,47.01 0 bottom
U$74  [#6#SCL#14]  4.66,49.56 0 bottom
U$75  [#5#SDA#14]  4.79,52.07 0 bottom
U$76  [#0#SCK#14]  18.16,39.37 0 bottom
U$77  [#14#A0#15]  18.23,24.11 0 bottom
U$78  [CHG0]  21.81,9.01 90 top
U$79  [RESET0]  18.7,10.43 90 top
U$80  [#15#A1#15]  18.37,26.65 0 bottom
U$81  [#16#A2#16]  18.24,29.2 0 bottom
U$82  [#17#A3#17]  18.22,31.74 0 bottom
U$83  [#18#A4#18]  18.22,34.28 0 bottom
U$84  [#19#A5#19]  18.26,36.82 0 bottom
U$85  [#20#20]  19.52,52.06 0 bottom
U$86  [#GND#0]  6.14,67.32 0 bottom
U$87  [#21#21]  19.63,57.1 0 bottom
U$88  [#22#22]  19.5,59.62 0 bottom
U$89  [#23#23]  19.48,62.18 0 bottom
U$90  [#24#TX#24]  17.97,64.72 0 bottom
U$91  [#25#RX#25]  18.09,67.28 0 bottom
U$92  [#26#26]  3.29,57.16 0 bottom
U$93  [#27#27]  3.29,59.7 0 bottom
U$94  [#28#28]  3.29,62.24 0 bottom
U$95  [#29#29]  3.29,64.78 0 bottom
USBSHLD  6.55,3.48 180 bottom

### Tracks (layer width: path | path; a pad name or v marks a point on that pad's centre or on a via)
3.3V  (via drill 0.25, 0.38)
  Top 0.203: U2.6 13.15,15.16 | 13.14,15.17 13.14,15.16 13.14,15.2 13.15,15.21 | R1.1 20.07,16.85 20.41,16.51 J1.27
  Top 0.254: U2.5 13.37,15.66 13.14,15.44 13.14,15.2 | 13.15,15.21 13.15,15.16 | 13.14,15.17 13.14,14.49 13.51,14.12 C3.1 | U2.7 14.89,13.54 14.73,13.37 14.39,13.37 14.25,13.51 C3.1 | C3.1 C2.1 13.51,11.86 13.72,11.66 v13.83,11.66
  Top 0.508: J3.2 6.31,9.9 v6.36,9.94 | v10.25,29.18 v10.24,29.18 9.89,28.84 9.89,28.47 9.36,27.93 C1.1 C10.1 8.82,26.07 8.45,25.69 U3.5 | v13.37,39.4 13.34,39.37 C4.1 12.33,39.42 U1.F1
  Route15 0.254: v13.83,11.66 v13.83,11.65 13.83,11.63
  Route15 0.508: v6.36,9.94 9.57,9.94 11.26,11.63 13.83,11.63 15.33,11.63
  Bottom 0.203: LED.1 10.69,28.74 v10.25,29.18
  other vias: 13.38,40.25 14.5,40.24 14.51,39.36 9.59,29.18 9.58,29.86 10.22,29.85
  pour Route15 (isolate 0.305, rank 2): 0,67.94 22.86,67.94 22.86,0 0,0
  pour Top (isolate 0.305): 14.73,40.46 13.11,40.46 13.11,39.17 14.73,39.17
  pour Top (isolate 0.305): 10.47,28.95 9.35,28.95 9.35,30.06 10.47,30.06
CC1
  Top 0.178: J5.A5 10.18,6.93 9.36,7.75 9.36,11.49 10.28,12.41 R12.2
CC2
  Top 0.178: J5.B5 13.18,7.66 13.71,8.19 R11.2
CHG  (via drill 0.25)
  Top 0.203: v14.02,25.4 14,25.42 U4.1 | v19.68,9.78 19.72,9.82 D1.C
  Bottom 0.203: v14.02,25.4 13.48,25.4 11.56,23.48 11.56,16.5 15.16,12.9 15.16,10.69 16.08,9.78 v19.68,9.78
CHIP_EN  (via drill 0.25)
  Top 0.178: U1.K11 19.53,60.61 20.03,61.11 v20.55,61.11
  Top 0.203: v16.79,11.48 15.94,11.48 15.91,11.51 S1.1 S1.2
  Bottom 0.178: 20.14,60.7 20.14,22.72
  Bottom 0.203: J1.28 21.59,12.37 20.7,11.48 v16.79,11.48 16.79,12.45 18.12,13.78 JP1.2 18.05,18.62 18.05,20.64 20.14,22.72 | v20.55,61.11 20.14,60.7
DTR
  Top 0.203: U2.23 15.39,19.57 16.01,20.19 16.01,22.63 | Q2.1 16.01,22.63 | 16.01,22.63 | 16.01,22.63 15.54,23.1 15.54,24.29 15.54,25.05 15.63,25.13 R17.1
EN
  Top 0.203: J1.11 1.27,25.59 1.48,25.37 2.18,25.37 2.46,25.09 2.46,24.4 2.78,24.07 3.06,24.07 R8.2 3.6,24.01 3.82,23.79 U3.3
GND  (via drill 0.25)
  Top 0.178: 13.18,17.16 13.17,17.15
  Top 0.203: 15.07,17.17 15.06,17.16 U2.2 13.18,17.16
  other vias: 16.08,16.39 7.57,7.3 6.65,7.34 15.27,7.25 16.24,7.25 12.46,14.3 10.56,40.44 12.2,24.9 13.02,27.3 13.16,17.31 13.77,10.84 13.31,30.27 5.52,24.72 6.17,26.57 7.59,15.71 6.22,15.74 4.59,15.84 4.34,16.52 4.31,17.16 6.93,15.71 15.22,16.39 16.13,17.38 17.05,16.39 16.11,15.43 9.92,15.34 17.75,1.25 21.56,5.06 5.05,1.25 1.24,5.06 1.27,15.89 1.26,19.54 21.94,7.81 22.01,10.82 12.83,7.99 10.01,7.99 13.31,9.18 5.2,19.9 7.08,20.51 4.01,23.13 3.39,27.82 9.62,17.84 7.28,17.84 9.91,11.24 11.26,30.3 8.46,30.71 9.03,33.64 11.43,33.59 13.18,33.57 15.75,33.51 17.95,33.49 17.09,36.01 15.49,36.04 13.7,36.02 18.05,40.74 15.36,40.41 8.6,39.41 1.92,43.18 5.06,37.82 5.22,32.72 21.56,54.08 3.91,55.89 3.81,58.91 4.31,63.71 2.52,58.44 2.17,8.44 3.78,9.7 5.04,11.77 9.02,36.12 5.18,35.95 3.3,33.52 9.72,12.75 5.05,3.79 17.75,3.79 11.44,7.78 16.84,66.36 13.22,66.37 9.63,66.38 5.99,66.37 6.02,64.48 9.67,64.46 13.26,64.48 16.81,64.44 5.99,60.98 9.58,60.95 13.24,60.92 16.86,60.95 16.86,59.13 13.26,59.09 9.58,59.14 6.06,59.14 6.02,57.34 9.63,57.34 13.25,57.35 16.86,57.3 16.84,55.49 13.24,55.55 9.66,55.57 6.04,55.57 6.04,53.77 9.7,53.78 13.25,53.76 16.86,53.65 16.88,50.16 13.25,50.15 9.61,50.15 5.93,50.24 5.95,48.28 9.59,48.31 13.29,48.26 16.87,48.22 5.98,46.49 9.61,46.56 13.29,46.56 16.95,46.62 16.89,42.98 13.16,42.96 9.58,62.63 13.24,62.64 16.85,62.72 6.03,62.82 6.06,52.09 9.71,52.18 13.23,52.01 16.84,52.01 16.91,44.59 13.28,44.69 18.84,27.7 9.09,34.59 17.58,37.72 4.01,42.9 20.17,62.39 20.1,64.23 19.34,25.87
  pour Route2 (isolate 0.254): 0,67.94 22.86,67.94 22.86,0 0,0
  pour Top (isolate 0.178, rank 2): 0,0 0,67.94 22.86,67.94 22.86,0
  pour Bottom (isolate 0.152, rank 2): 0,0 22.86,0 22.86,67.94 0,67.94
LP_UART_RXD  (via drill 0.25)
  Top 0.178: v2.49,63.92 3.06,64.49 4.29,64.49 U1.B13
  Route15 0.178: J1.15 21.57,46.99 19.44,49.12 v16.87,49.12
  Bottom 0.178: v2.49,63.92 2.47,63.91 2.47,62.01 15.37,49.12 v16.87,49.12
LP_UART_TXD  (via drill 0.25)
  Top 0.178: v3.98,63.14 3.84,63.14 U1.A13
  Route15 0.178: J1.14 20.1,51.02 v16.84,51.02
  Bottom 0.178: v16.84,51.02 16.84,51.01 15.29,51.01 3.98,62.33 v3.98,63.14 | v3.98,63.14
N$1
  Top 0.203: U2.9 15.89,13.71 16.01,13.6 17.92,13.6 19.58,15.26 R1.2
N$2
  Top 0.203: R4.2 3.75,29.07 4.4,28.42 D3.A
N$3
  Top 0.203: Q2.5 19.53,21.98 19.92,22.37 19.92,23.16 17.94,25.13 R17.2
N$4
  Top 0.203: U2.8 15.39,13.42 15.54,13.27 18.32,13.27 19.07,12.51 R5.1 R9.2
N$5
  Top 0.203: Q2.2 17.12,21.98 17.33,22.2 17.33,22.82 17.01,23.14 16.3,23.14 16.13,23.32 R18.2
N$6  (via drill 0.25)
  Top 0.203: v18.67,20.32 17.98,20.32 17.52,20.79 17.52,21.08 17.26,21.33 Q2.3
  Bottom 0.203: JP1.1 19.16,19.82 v18.67,20.32
N$7
  Top 0.203: Q1.1 13.81,20 14.05,20.24 14.28,20.48 14.31,20.51 R10.2
N$8
  Top 0.203: R15.2 8.72,13.6 8.58,13.46 S2.4 S2.3
N$9  (via drill 0.25)
  Top 0.203: U4.5 10.38,26.36 v10.19,26.16
  Bottom 0.203: v10.19,26.16 10.31,26.16 10.57,25.91 10.57,25.38 10.29,25.09 CHG.2
N$10  (via drill 0.25)
  Top 0.203: v19.01,23.28 19.07,23.22 19.07,22.75 18.95,22.63 Q2.6
  Bottom 0.203: v19.01,23.28 16.7,23.28 16.06,22.64 JP2.1
N$11  (via drill 0.25)
  Top 0.203: R13.1 9.71,23.09 v8.97,23.09
  Bottom 0.203: CHG.1 7.72,26.14 7.34,25.76 7.34,23.62 7.87,23.09 v8.97,23.09
N$12  (via drill 0.25)
  Top 0.203: v15.13,28.15 15.13,28.96 R2.1
  Bottom 0.203: LED.2 14.54,28.74 v15.13,28.15
N$13  (via drill 0.25)
  Top 0.203: R6.2 9.45,24.17 9.65,23.96 v10.31,23.96
  Bottom 0.203: CHG.3 10.22,24.05 v10.31,23.96
N$14
  Top 0.203: D4.A 17.05,29.29 R2.2
N$15
  Top 0.203: U2.3 12.7,16.66 11.32,15.28 11.32,11.08 10.93,10.69 D6.6
N$16  (via drill 0.25)
  Top 0.203: D6.1 10.96,8.46 10.96,7.58 11.18,7.36 J5.A6 v11.18,5.33 | v12.19,5.32 v12.18,5.32 J5.B6
  Bottom 0.203: v11.18,5.33 12.18,5.33 v12.19,5.32
N$17
  Top 0.178: R3.2 20.4,6.17 20.7,6.46 D1.A
N$18
  Top 0.203: D6.4 11.93,10.81 11.69,11.04 11.69,15.09 12.77,16.16 U2.4
N$19
  Top 0.203: D6.3 11.93,7.54 11.68,7.29 J5.A7 11.68,5.12 11.41,4.84 10.87,4.84 10.68,5.04 J5.B7
PA0
  Top 0.178: U1.K8 21,54.65 21.59,55.24 J6.1
PA2
  Top 0.178: U1.K10 19.55,58.25 20.36,59.06 20.36,60.17 21.09,60.91 21.38,60.91 21.59,61.12 J6.3
PA4
  Top 0.178: U1.K9 20.32,57.24 20.32,58.42 J6.2
PA7/UART-LOG-TXD  (via drill 0.25)
  Top 0.178: S2.1 6.98,14.4 8.48,15.9 11.08,15.9 12.54,17.37 v12.54,17.94 | U1.K12 19.53,62.7 J6.4
  Top 0.203: U2.20 16.89,19.45 17.09,19.65 v17.09,20.1 | S2.1 S2.2
  Bottom 0.178: v17.09,20.1 17.09,18.89 16.14,17.94 v12.54,17.94 | v12.54,17.94 | 19.36,62.38 19.36,62.54 J6.4
  Bottom 0.203: 19.36,62.38 19.36,26.98 15.02,22.64 JP2.2 15.02,20.78 15.4,20.39 16.8,20.39 v17.09,20.1
PA8/UART-LOG-RXD  (via drill 0.25)
  Top 0.178: U1.K13 19.53,64.39 20.34,65.2 20.34,66.06 J6.5
  Top 0.203: U2.21 16.39,19.23 v16.16,19.47 v16.16,19.48
  Bottom 0.178: 18.56,28.29 18.56,64.28 J6.5
  Bottom 0.203: v16.16,19.48 14.78,19.48 14.05,20.2 14.05,23.79 18.56,28.29
PA14
  Top 0.178: U1.A12 2.5,62.68 2.5,62.86 1.91,63.45 1.5,63.45 1.27,63.69 J7.2
PA15
  Top 0.178: U1.B12 4.46,61.18 2.32,61.18 J7.3
PA16/PICO  (via drill 0.25)
  Top 0.178: U1.A11 2.91,60.47 v2.48,60.47
  Route15 0.178: J1.17 18.22,38.55 v17.31,38.55
  Bottom 0.178: v17.31,38.55 16.85,38.09 8.11,38.09 4.65,41.55 4.65,57.22 2.77,59.09 2.77,60.19 v2.48,60.47
PA17/POCI  (via drill 0.25)
  Top 0.178: U1.B11 5.13,59.41 v4.55,58.83
  Route15 0.178: J1.16 19.6,42.46 19.6,41.54 18.3,40.23 v17.25,40.23
  Bottom 0.178: v17.25,40.23 17.25,40.2 15.86,38.81 8.52,38.81 5.38,41.94 5.38,57.72 4.55,58.55 v4.55,58.83
PA18/SCK  (via drill 0.25)
  Top 0.178: U1.A10 3.82,57.76 v3.82,57.3
  Route15 0.178: J1.18 19.15,36.93 v17.43,36.93
  Bottom 0.178: v17.43,36.93 16.97,37.39 7.83,37.39 3.35,41.86 3.35,56.84 v3.82,57.3
PA19/CS
  Top 0.178: U1.B10 5.13,57.39 4.44,56.7 4.44,48.63 3.87,48.06 3.08,48.06 2.72,47.7 2.72,45.9 J1.4
PA25/SCL  (via drill 0.25)
  Top 0.203: J3.4 3.71,7.9 2.79,8.81 v2.79,8.87 | U1.A5 2.73,49.25 2.45,49.53 J1.2
  Bottom 0.178: J1.2 2.44,48.36 2.44,9.22 v2.79,8.87
PA26/SDA  (via drill 0.25)
  Top 0.203: J3.3 3.79,8.9 v3.79,8.89 | U1.A6 2.3,51.05 J1.1
  Bottom 0.178: J1.1 2.8,50.55 2.8,9.88 v3.79,8.89
PA27
  Top 0.178: U1.A9 2.44,57.34 2.44,57.73 1.81,58.36 1.46,58.36 1.27,58.55 J7.4
PA28
  Top 0.178: U1.A7 1.27,54.91 J7.5
PA30
  Top 0.178: U1.A8 4.04,53.94 4.04,48.87 3.6,48.43 2.71,48.43 J1.3
PB1/A4
  Top 0.178: U1.A3 4.39,44.59 7.14,44.59 7.56,44.17 7.56,43.31 8.2,42.68 8.97,42.68 9.33,42.32 9.33,41.78 7.22,39.67 7.22,33.71 8.28,32.65 19.95,32.65 J1.20
PB2/A5
  Top 0.178: U1.A4 4.03,46.75 4.03,45.53 4.6,44.96 7.5,44.96 8.02,44.43 8.02,43.45 8.38,43.09 9.26,43.09 9.69,42.67 9.69,41.61 7.61,39.53 7.61,33.97 8.56,33.01 18.64,33.01 20.29,34.66 20.29,35.55 21.57,36.83 J1.19
PB3/A6
  Top 0.178: U1.B1 3.82,40.74 2.44,40.74 J1.5
PB4/A0
  Top 0.178: U1.B2 5.78,43.2 5.78,32.99 7.5,31.26 18.2,31.26 19.89,29.58 19.89,25.83 J1.24
PB5/A1
  Top 0.178: U1.C1 6.93,41.55 6.12,40.73 6.12,33.25 7.75,31.61 18.52,31.61 20.3,29.83 20.3,27.95 J1.23
PB6/A2
  Top 0.178: U1.C2 6.93,42.93 7.54,42.33 7.54,41.66 6.47,40.59 6.47,33.46 7.96,31.96 18.84,31.96 J1.22
PB7/A3
  Top 0.178: U1.D1 6.84,40.16 6.84,33.59 8.12,32.32 19.59,32.32 20.16,31.75 J1.21
PB22  (via drill 0.25)
  Top 0.178: U1.K1 19.53,36.5 18.04,35.01 11.79,35.01 11.15,35.66 v10.75,35.66 | v4.29,35.85 3.32,36.82 J1.7
  Bottom 0.178: v10.75,35.66 10.63,35.54 5.94,35.54 5.82,35.43 4.71,35.43 v4.29,35.85
PB23  (via drill 0.25)
  Top 0.178: U1.K2 18.9,43.22 18.9,36.38 17.9,35.38 12.12,35.38 10.99,36.51 v9.8,36.51 | v3.31,37.83 3.31,38.6 2.54,39.37 J1.6
  Bottom 0.178: v9.8,36.51 9.72,36.6 5.06,36.6 3.83,37.83 v3.31,37.83
PB26  (via drill 0.25)
  Top 0.152: U1.K5 19.53,48.27 20.13,47.67 20.13,41.13 20.02,41.02 20.02,36.49
  Top 0.178: 20.02,36.49 18.18,34.64 11.16,34.64 10.73,35.06 v9.99,35.06 | J1.8 2.72,34.29 3.42,34.99 v3.42,35.42
  Bottom 0.178: v9.99,35.06 3.78,35.06 v3.42,35.42
PB29  (via drill 0.25)
  Top 0.178: U1.K6 20.42,50.16 20.42,36.4 18.31,34.29 v10.01,34.29 | J1.9 2.52,33 v3.75,33
  Top 0.203: R4.1 v3.75,33
  Bottom 0.178: v10.01,34.29 9.84,34.12 4.87,34.12 v3.75,33
PB31
  Top 0.178: U1.K7 20.81,52.85 J1.13
RTS
  Top 0.203: R18.1 17.61,24.02 17.87,23.76 17.87,21.66 18.2,21.33 Q2.4 19.01,21.33 19.15,21.19 19.15,20 18.96,19.8 17.75,19.8 17.39,19.44 U2.19
USB_SHLD  (via drill 0.25)
  other vias: 9.68,4.72
  pour Top (isolate 0.254): 16.15,5.82 6.73,5.82 6.73,1.27 16.15,1.27
  pour Bottom (isolate 0.254): 6.73,1.27 16.15,1.27 16.15,6.35 6.73,6.35
V_BATT  (via drill 0.25)
  Top 0.178: v9.59,44.67 8.77,43.85 U1.D2
  Top 0.203: C6.1 14.19,29.24 v14.19,30.09
  Top 0.508: J1.12 1.25,24.11 1.25,22.78 1.55,22.48 3.89,22.48 4.27,22.1 4.27,19 4.5,18.77 J2.2 7.17,19.57 7.42,19.81 9.04,19.81 10.19,20.95 Q1.3 11.57,20.95 12.09,21.47 12.09,23.8 12.94,24.65 12.94,26.33 12.37,26.91 12.37,27.65 12.98,28.25 U4.3 14.16,28.25 C6.1
  Route15 0.203: v14.19,30.09 14.19,33.81 9.59,38.42 v9.59,44.67
V_USB  (via drill 0.25, 0.38)
  Top 0.178: v17.83,6.63 17.83,6.59 18.26,6.17 R3.1
  Top 0.203: R5.2 19.83,14.62 v19.77,14.68 | R7.2 R10.1 14.79,22 14.94,21.85 14.94,20.5 13.73,19.29 13.48,19.05 v13.08,19.05 | D6.5 v11.43,10.03 v11.44,10.04
  Top 0.508: J5.VBUS2 13.88,7.28 v13.87,7.29 | J5.VBUS1 v8.98,7.28 v8.97,7.29 | D2.A v10.55,18.04 v10.55,18.79 | v10.05,27.3 v10.05,27.31 10.05,27.69 10.62,28.25 11.09,28.25 | 11.09,28.25 U4.4 | C19.1 11.1,28.26 11.09,28.25
  Route15 0.203: v19.77,14.68 14.15,14.68 | v17.83,6.63 17.83,5.56 16.28,4.01 14.05,4.01 14.02,4.04
  pour Route15 (isolate 0.254): 14.43,0 14.43,19.61 10.87,23.16 10.87,27.18 7.57,30.48 0,30.48 0,0
VIN  (via drill 0.38)
  Top 0.203: R8.1 3.12,25.52 3.3,25.69 U3.1
  Top 0.508: D2.C 11.56,19.57 12.17,20.17 12.17,20.62 12.45,20.9 12.78,20.9 13.08,21.21 13.08,21.89 Q1.2 13.06,22.76 v13.09,22.78 | U3.1 5.71,25.69 6.16,25.23 6.16,23.27 5.95,23.05 C7.1 5.95,21.38 v6.04,21.29 v6.05,21.29 v6.82,21.29
  Route15 0.508: v6.04,21.29 v6.05,21.3 11.6,21.3 v13.09,22.78 v13.08,22.78 v13.08,23.58
  pour Top (isolate 0.305): 13.34,22.54 12.83,22.54 12.83,23.79 13.34,23.79

### Text on the board
Top: 1
Route2: 2
Route15: 3
Bottom: 4 | v10
tPlace: + | -
Measures: Measure Units: INCHES
tDocu: Pete Lewis | Based on designs by: M. Hord, A. Wende